# Altium schematic sheet STM32_Overview.SchDoc
size A; SheetNumber: 1; SheetTotal: 4
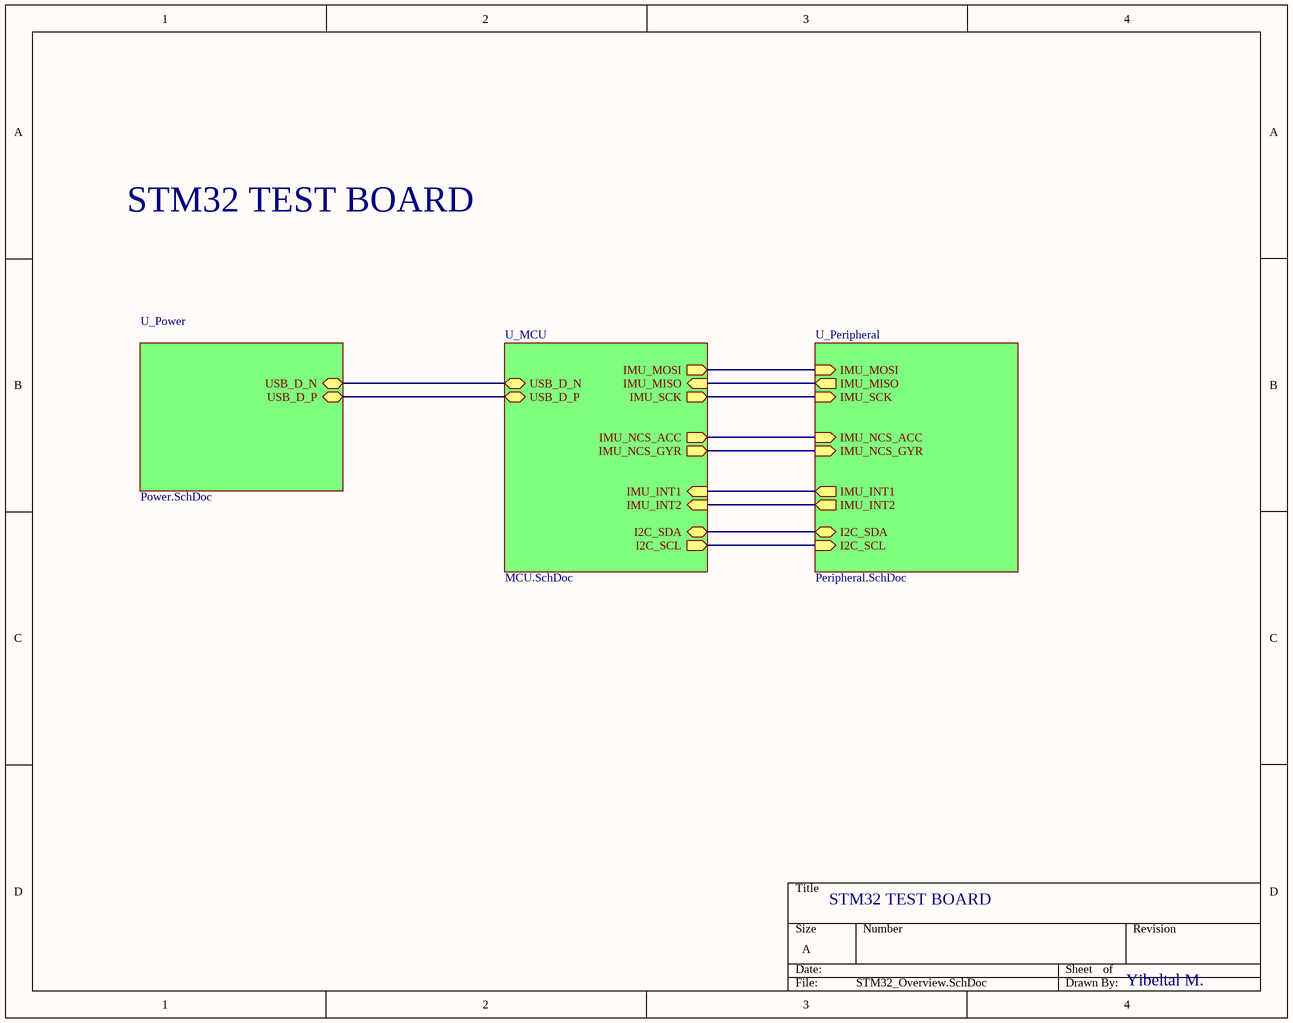
[diagram p0: STM32_Overview.SchDoc]

## Sub-sheets
U_MCU = MCU.SchDoc: USB_D_N (bidir), USB_D_P (bidir), IMU_NCS_ACC (out), IMU_NCS_GYR (out), IMU_SCK (out), IMU_MOSI (out), IMU_MISO (in), I2C_SCL (out), I2C_SDA (bidir), IMU_INT1 (in), IMU_INT2 (in)
U_Peripheral = Peripheral.SchDoc: IMU_SCK (in), IMU_MOSI (in), IMU_MISO (out), IMU_NCS_ACC (in), IMU_NCS_GYR (in), I2C_SCL (in), I2C_SDA (bidir), IMU_INT1 (out), IMU_INT2 (out)
U_Power = Power.SchDoc: USB_D_N (bidir), USB_D_P (bidir)

## Nets
(unnamed): sheet U_Power/USB_D_N, sheet U_MCU/USB_D_N
(unnamed): sheet U_Power/USB_D_P, sheet U_MCU/USB_D_P
(unnamed): sheet U_MCU/IMU_NCS_ACC, sheet U_Peripheral/IMU_NCS_ACC
(unnamed): sheet U_MCU/IMU_NCS_GYR, sheet U_Peripheral/IMU_NCS_GYR
(unnamed): sheet U_MCU/IMU_SCK, sheet U_Peripheral/IMU_SCK
(unnamed): sheet U_MCU/IMU_MOSI, sheet U_Peripheral/IMU_MOSI
(unnamed): sheet U_MCU/IMU_MISO, sheet U_Peripheral/IMU_MISO
(unnamed): sheet U_MCU/I2C_SCL, sheet U_Peripheral/I2C_SCL
(unnamed): sheet U_MCU/I2C_SDA, sheet U_Peripheral/I2C_SDA
(unnamed): sheet U_MCU/IMU_INT1, sheet U_Peripheral/IMU_INT1
(unnamed): sheet U_MCU/IMU_INT2, sheet U_Peripheral/IMU_INT2

## Notes on the sheet
- STM32 TEST BOARD
- Yibeltal M.